# EAGLE design PiPowerHat (EAGLE 7.4.0)
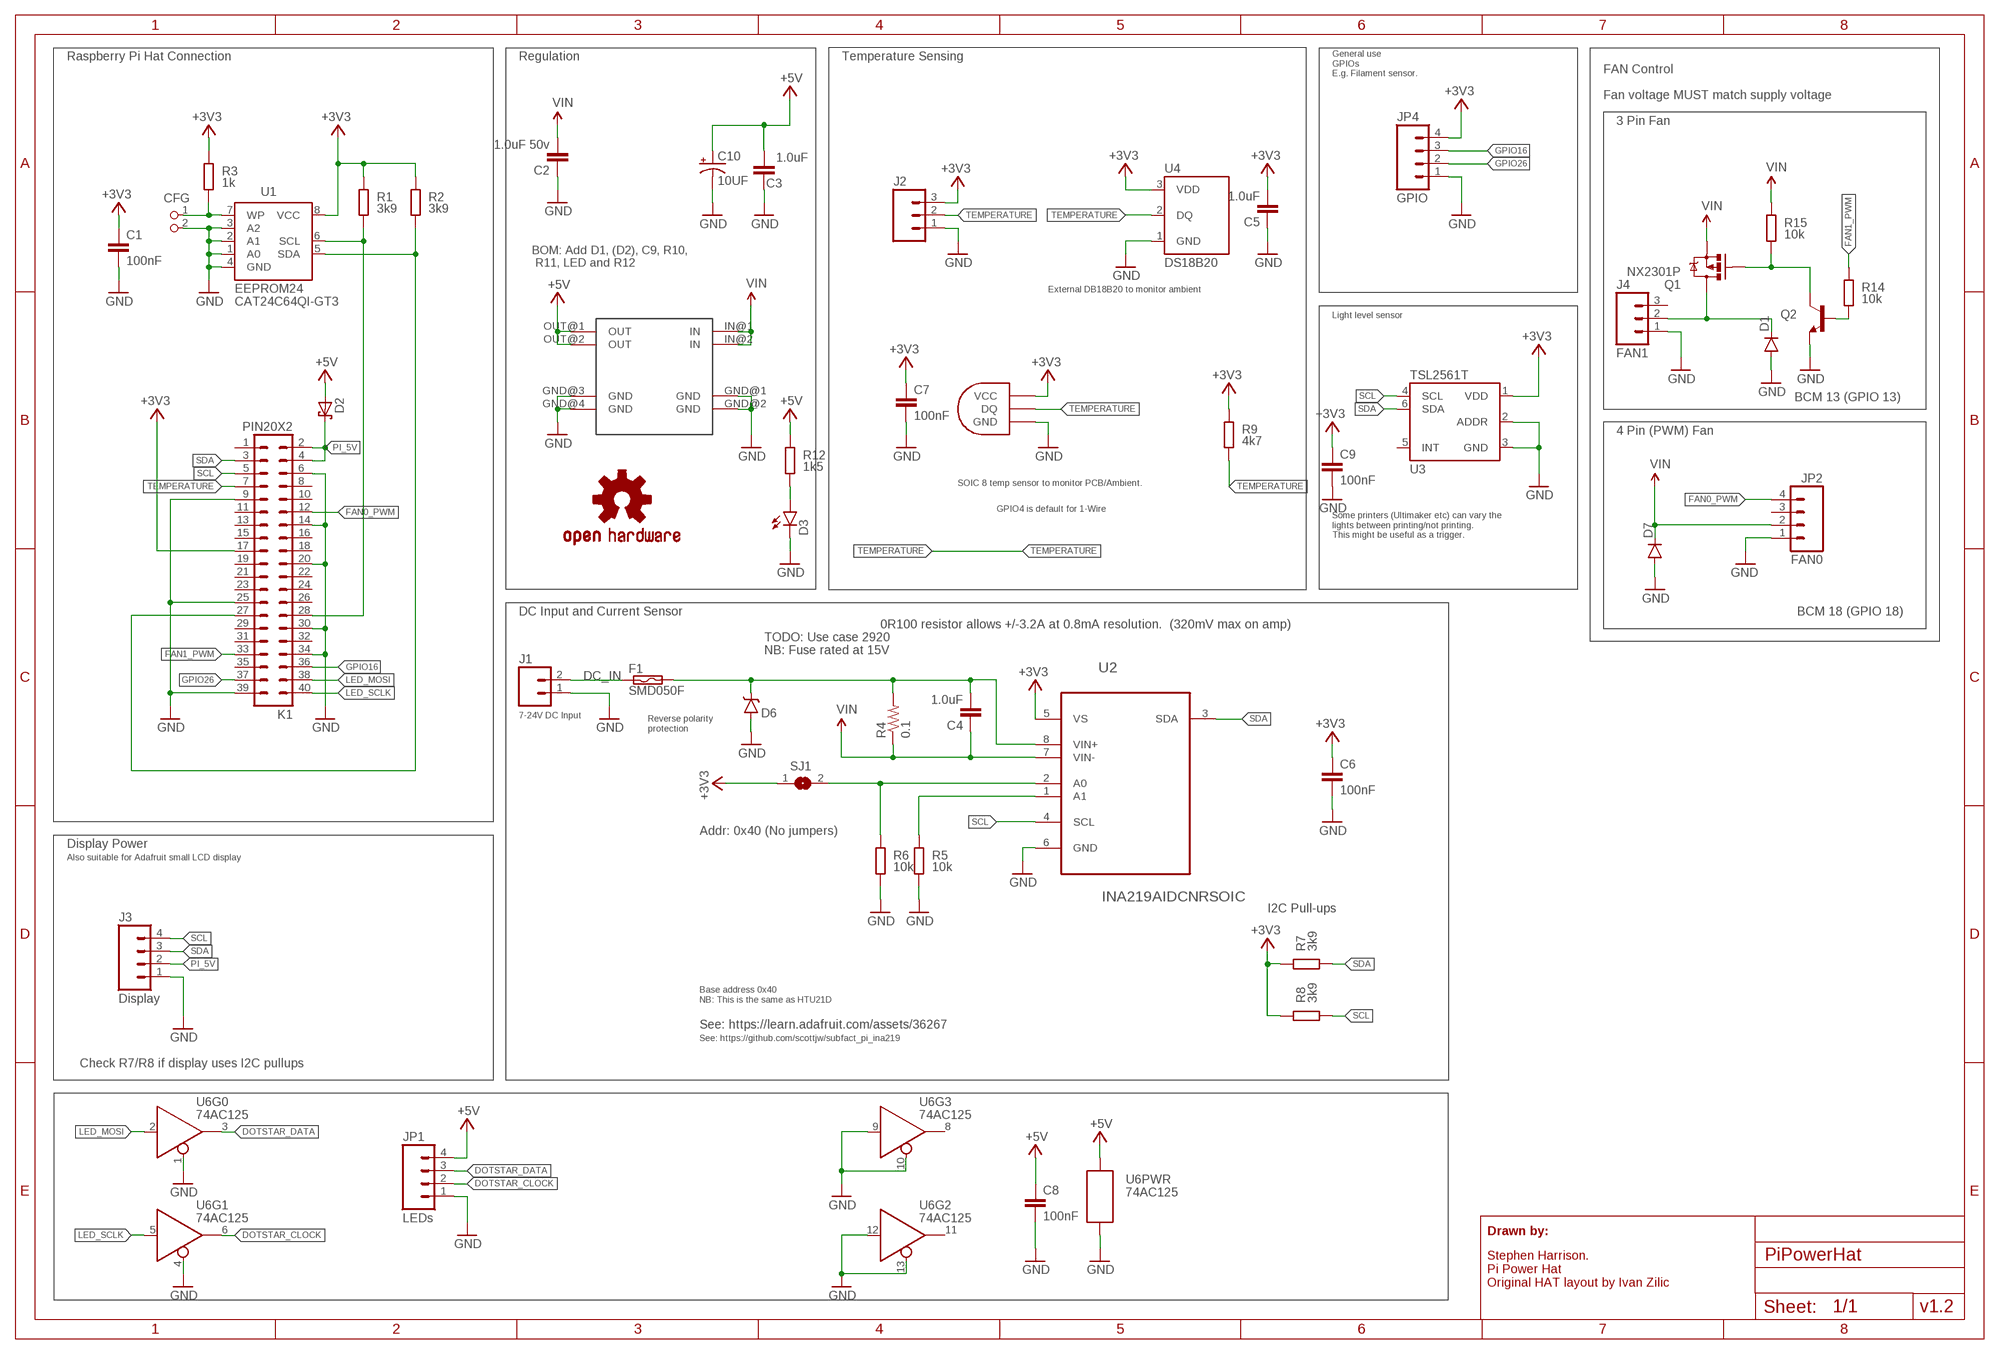
[diagram p0: schematic, sheet 1]

## Parts
C1  100nF  C-EUC0805K  [C0805K]
C2  1.0uF 50v  1.0UF-25V-+80/-20(0805)"  [0805-CAP]
C3  1.0uF  1.0UF-25V-+80/-20(0805)"  [0805-CAP]
C4  1.0uF  1.0UF-25V-+80/-20(0805)"  [0805-CAP]
C5  1.0uF  1.0UF-25V-+80/-20(0805)"  [0805-CAP]
C6  100nF  C-EUC0805K  [C0805K]
C7  100nF  C-EUC0805K  [C0805K]
C8  100nF  C-EUC0805K  [C0805K]
C9  100nF  C-EUC0805K  [C0805K]
C10  10UF  10UF-25V-10%(SMT-TANT)  [EIA6032-NOM]
CFG  PIN2_100  [PIN_W_2]
D1  DIODESOD123  [SOD-123]
D2  MBRS340T3G  SCHOTTKY-DIODESMC  [SMC]
D3  LED1206-BOTTOM  [LED-1206-BOTTOM]
D6  B340A  DIODE-SCHOTTKY-B340A  [SMA-DIODE]
D7  DIODESOD123  [SOD-123]
F1  SMD050F  [SMD050F]
J1  M025MM  [SCREWTERMINAL-5MM-2]
J2  M03POLAR  [MOLEX-1X3]
J3  Display  M04POLAR  [MOLEX-1X4]
J4  FAN1  M03POLAR  [MOLEX-1X3]
JP1  LEDs  M04POLAR  [MOLEX-1X4]
JP2  FAN0  M04POLAR  [MOLEX-1X4]
JP4  GPIO  M04POLAR  [MOLEX-1X4]
K1  PIN20X2  [PIN_20X2]
LOGO1  OSHW-LOGOM  [OSHW-LOGO-M]
Q1  NX2301P  MOSFET-PCHANNEL  [SOT23-3]
Q2  TRANSISTOR_NPNSOT23-3  [SOT23-3]
R1  3k9  R-EU_M0805  [M0805]
R2  3k9  R-EU_M0805  [M0805]
R3  1k  R-EU_M0805  [M0805]
R4  0.1  0.001OHM-3W-1%(2512)3W/1%  [2512]
R5  10k  R-EU_M0805  [M0805]
R6  10k  R-EU_M0805  [M0805]
R7  3k9  R-EU_M0805  [M0805]
R8  3k9  R-EU_M0805  [M0805]
R9  4k7  R-EU_M0805  [M0805]
R12  1k5  R-EU_M0805  [M0805]
R14  10k  R-EU_M0805  [M0805]
R15  10k  R-EU_M0805  [M0805]
SJ1  SJ  [SJ]
U1  EEPROM24  [SOIC8]
U2  INA219AIDCNRSOIC  [SO08]
U3  TSL2561T  [TMB-6]
U4  DS18B20  [TO-92-AMMO]
U5  DS1820SOIC  [DS18B20_SOIC]
U6  74AC125  74AC125DG125  [SO14]
U$1  MINI-BUCK-MODULE-3A  [MINI-BUCK-MODULE-3A]

## Nets
+3V3: C1.1 C5.2 C6.1 C7.1 C9.1 J2.3 JP4.4 K1.17 R1.2 R2.2 R3.2 R7.2 R8.2 R9.2 SJ1.1 U1.8(VCC) U2.5(VS) U3.1(VDD) U4.3(VDD) U5.VCC
+5V: C3.2 C8.1 C10.A(+) D2.A JP1.4 R12.2 U6.14(PWR:P$V+) U$1.OUT@1(OUT) U$1.OUT@2(OUT)
DC_IN: F1.1 J1.2
DOTSTAR_CLOCK: JP1.2 U6.6(Q)
DOTSTAR_DATA: JP1.3 U6.3(Q)
FAN0_PWM: JP2.4 K1.12
FAN1_PWM: K1.33 R14.2
GND: C1.2 C2.1 C3.1 C5.1 C6.2 C7.2 C8.2 C9.2 C10.C(-) CFG.2 D1.A D3.C D6.A D7.A J1.1 J2.1 J3.1 J4.1 JP1.1 JP2.1 JP4.1 K1.6 K1.9 K1.14 K1.20 K1.25 K1.30 K1.34 K1.39 Q2.2(E) R5.1 R6.1 U1.1(A0) U1.2(A1) U1.3(A2) U1.4(GND) U2.6(GND) U3.2(ADDR) U3.3(GND) U4.1(GND) U5.GND U6.1(!EN) U6.4(!EN) U6.7(PWR:P$V-) U6.9(D) U6.10(!EN) U6.12(D) U6.13(!EN) U$1.GND@1(GND) U$1.GND@2(GND) U$1.GND@3(GND) U$1.GND@4(GND)
GPIO16: JP4.3 K1.36
GPIO26: JP4.2 K1.37
ID_SC: K1.28 R1.1 U1.6(SCL)
ID_SD: K1.27 R2.1 U1.5(SDA)
LED_MOSI: K1.38 U6.2(D)
LED_SCLK: K1.40 U6.5(D)
N$3: CFG.1 R3.1 U1.7(WP)
N$4: D3.A R12.1
N$5: C4.2 D6.C F1.2 R4.2 U2.8(VIN+)
N$7: D1.C J4.2 Q1.3(D)
N$8: Q1.1(G) Q2.3(C) R15.1
N$9: R6.2 SJ1.2 U2.2(A0)
N$10: R5.2 U2.1(A1)
N$13: Q2.1(B) R14.1
PI_5V: D2.C J3.2 K1.2 K1.4
SCL: J3.4 K1.5 R8.1 U2.4(SCL) U3.4(SCL)
SDA: J3.3 K1.3 R7.1 U2.3(SDA) U3.6(SDA)
TEMPERATURE: J2.2 K1.7 R9.1 U4.2(DQ) U5.DQ
VIN: C2.2 C4.1 D7.C JP2.2 Q1.2(S) R4.1 R15.2 U2.7(VIN-) U$1.IN@1(IN) U$1.IN@2(IN)
Unconnected: J4.3 JP2.3 K1.1 K1.8 K1.10 K1.11 K1.13 K1.15 K1.16 K1.18 K1.19 K1.21 K1.22 K1.23 K1.24 K1.26 K1.29 K1.31 K1.32 K1.35 U3.5(INT) U6.8(Q) U6.11(Q)

## Notes on the sheet
- Raspberry Pi Hat Connection | Regulation | Temperature Sensing
- FAN Control
- General use
  GPIOs
  E.g. Filament sensor.
- Fan voltage MUST match supply voltage
- 3 Pin Fan
- BOM: Add D1, (D2), C9, R10,
   R11, LED and R12
- External DB18B20 to monitor ambient
- CAT24C64QI-GT3
- Light level sensor
- BCM 13 (GPIO 13)
- 4 Pin (PWM) Fan
- SOIC 8 temp sensor to monitor PCB/Ambient.
- GPIO4 is default for 1-Wire
- Some printers (Ultimaker etc) can vary the 
  lights between printing/not printing. 
  This might be useful as a trigger.
- DC Input and Current Sensor | BCM 18 (GPIO 18)
- 0R100 resistor allows +/-3.2A at 0.8mA resolution.  (320mV max on amp)
- TODO: Use case 2920
- NB: Fuse rated at 15V
- 7-24V DC Input
- Reverse polarity
  protection
- Addr: 0x40 (No jumpers)
- Display Power
- Also suitable for Adafruit small LCD display
- I2C Pull-ups
- Base address 0x40
  NB: This is the same as HTU21D
- See: https://learn.adafruit.com/assets/36267
- See: https://github.com/scottjw/subfact_pi_ina219
- Check R7/R8 if display uses I2C pullups
- Drawn by:
- Stephen Harrison.
  Pi Power Hat 
  Original HAT layout by Ivan Zilic
- v1.2

## Library data of the parts
C1 C6-C9 = resistor:C-EU: CAPACITOR, European symbol; DIELECTRIC: X7R
C2 = SparkFun-Capacitors:1.0UF-25V-+80/-20(0805): CAP-11625; PROD_ID: CAP-11625; VALUE: 1.0uF
C3-C5 = SparkFun-Capacitors:1.0UF-25V-+80/-20(0805): CAP-11625; PROD_ID: CAP-11625
C10 = SparkFun-Capacitors:10UF-25V-10%(SMT-TANT): http://www.digikey.com/product-detail/en/T491C106K025AT7280/399-10159-2-ND/3759638; PROD_ID: CAP-12984
CFG = FLYFISH:PIN2
D1 D7 = SparkFun-DiscreteSemi:DIODE: Diode These are standard reverse protection diodes and small signal diodes. SMA package can handle up to about 1A. SOD-323 can handle about 200mA. What the SOD-323 package when ordering, there are some mfgs out there that are 5-pin packages.
D2 = diode:SCHOTTKY-DIODE: Schottky Diode; FARNELL: 9557377
D3 = SparkFun-LED:LED: LEDs Standard schematic elements and footprints for 5mm, 3mm, 1206, and 0603 sized LEDs. 5mm - Spark Fun Electronics SKU : COM-00529 (and others)
D6 = SparkFun-DiscreteSemi:DIODE-SCHOTTKY: Schottky diodes in SFE's production catalog BAT20J 1A 23V 0.62Vf RB751 120mA 40V 0.37Vf PMEG4005EJ 0.5A 40V 0.42Vf MBRA140 1A 40V 0.5Vf B340A 3A 40V SMA; PROD_ID: DIO-09886
F1 = switch-raychem:SMD*F: PolySwitch (TM) Resettable Device Source: Data sheet <http://www.farnell.com/datasheets/13482.pdf>; FARNELL: 1822231; FARNELL-1: 1822225
J1 = SparkFun-Connectors:M02: Standard 2-pin 0.1" header. Use with - straight break away headers ( PRT-00116) - right angle break away headers (PRT-00553) - swiss pins (PRT-00743) - machine pins (PRT-00117) - female headers (PRT-00115) Molex polarized connector foot print use with: PRT-08233 with associated crimp pins and housings. 2.54_SCREWTERM for use with PRT-10571. 3.5mm Screw Terminal footprints for PRT-08084 5mm Screw Terminal footprints for use with PRT-08432; STOREFRONT_ID: PRT-08432
J2 J4 = SparkFun-Connectors:M03: Header 3 Standard 3-pin 0.1" header. Use with straight break away headers (SKU : PRT-00116), right angle break away headers (PRT-00553), swiss pins (PRT-00743), machine pins (PRT-00117), and female headers (PRT-00115). Molex polarized connector foot print use with SKU : PRT-08232 with associated crimp pins and housings.
J3 JP1 JP2 JP4 = SparkFun-Connectors:M04: Header 4 Standard 4-pin 0.1" header. Use with straight break away headers (SKU : PRT-00116), right angle break away headers (PRT-00553), swiss pins (PRT-00743), machine pins (PRT-00117), and female headers (PRT-00115). Molex polarized connector foot print use with SKU : PRT-08231 with associated crimp pins and housings. 1MM SMD Version SKU: PRT-10208
K1 = FLYFISH:PIN20X2
LOGO1 = SparkFun-Aesthetics:OSHW-LOGO: Open Source Hardware Logo This logo indicates the piece of hardware it is found on incorporates a OSHW license and/or adheres to the definition of open source hardware found here: http://freedomdefined.org/OSHW
Q1 = SparkFun-DiscreteSemi:MOSFET-PCHANNEL: Generic PMOSFET IRLML2244 - TRANS-11153 (SOT-23 -20V -4.3A) (1.Gate 2.Source 3.Drain) FQP27P06 - COM-10349 <http://www.sparkfun.com/products/10349> (TO-220 -60V -27A) (1.Gate 2.Source 3.Drain); PROD_ID: TRANS-08285
Q2 = SparkFun-DiscreteSemi:TRANSISTOR_NPN: Generic NPN BJT MMBT2222A - TRANS-08049 (SOT-23, 1A 40V) MPSA42 - TRANS-09116 (SOT-23, 500mA 300V) MMBT5088LT1G - TRANS-11160 (SOT-23, 50 mA 30V) BC547 - COM-08928 <http://www.sparkfun.com/products/8928> (TO-92 45V 100mA) (1.Collector 2.Base 3.Emitter) 2N3904 - COM-00521 <http://www.sparkfun.com/products/521> (TO-92 40V 200mA) (1.Emitter 2.Base 3.Collector) P2N2222A - COM-12852 <http://www.sparkfun.com/products/12852> (TO-92 40V 600mA) (1.Collector 2.Base 3.Emitter); PROD_ID: TRANS-08049
R1-R3 R5-R9 R12 R14 R15 = resistor:R-EU_: RESISTOR, European symbol; TOLERANCE: 5%
R4 = SparkFun-Resistors:0.001OHM-3W-1%(2512); PROD_ID: RES-12449; VALUE: 0.001
SJ1 = jumper:SJ: SMD solder JUMPER
U1 = FLYFISH:EEPROM24; FARNELL: 2463718
U2 = INA219AIDCNR:INA219AIDCNR: CURRENT/POWER MONITOR
U3 = SparkFun-Sensors:TSL2561: TSL2561 illumination sensor Approximates Human Eye Response Precisely Measures Illuminance Programmable Interrupt Function with User-Defined Upper and Lower Threshold 400 KHz I2C interface Programmable Analog Gain and Integration Time Supporting 1,000,000-to-1 Dynamic Range Automatically Rejects 50/60-Hz Lighting Ripple Low Active Power (0.75 mW Typical) with Power Down Mode RoHS Compliant The TSL2561 is a light-to-digital converter that transform light intensity to a digital signal output via I2C interface. The device combines one broadband photodiode (visible plus infrared) and one infrared-responding photodiode on a single CMOS integrated circuit capable of providing a near-photopic response over an effective 20-bit dynamic range (16-bit resolution). Two integrating ADCs convert the photodiode currents to a digital output that represents the irradiance measured on each channel. This digital output can be input to a microprocessor where illuminance (ambient light level) in lux is derived using an empirical formula to approximate the human eye response. The TSL2561 device supports a traditional level style interrupt that remains asserted until the firmware clears it.
U4 = SparkFun-Sensors:DS18B20: Dallas/Maxim DS18B20 1-wire temperature sensor Datasheet: http://datasheets.maximintegrated.com/en/ds/DS18B20.pdf temp thermometer 1-wire one-wire one wire; STORE_ID: SEN-00245
U5 = DS1820-SOIC:DS1820
U6 = SparkFun-DigitalIC:74*125; PROD_ID: IC-08880
U$1 = Tinamous:MINI-BUCK-MODULE-3A

## Board
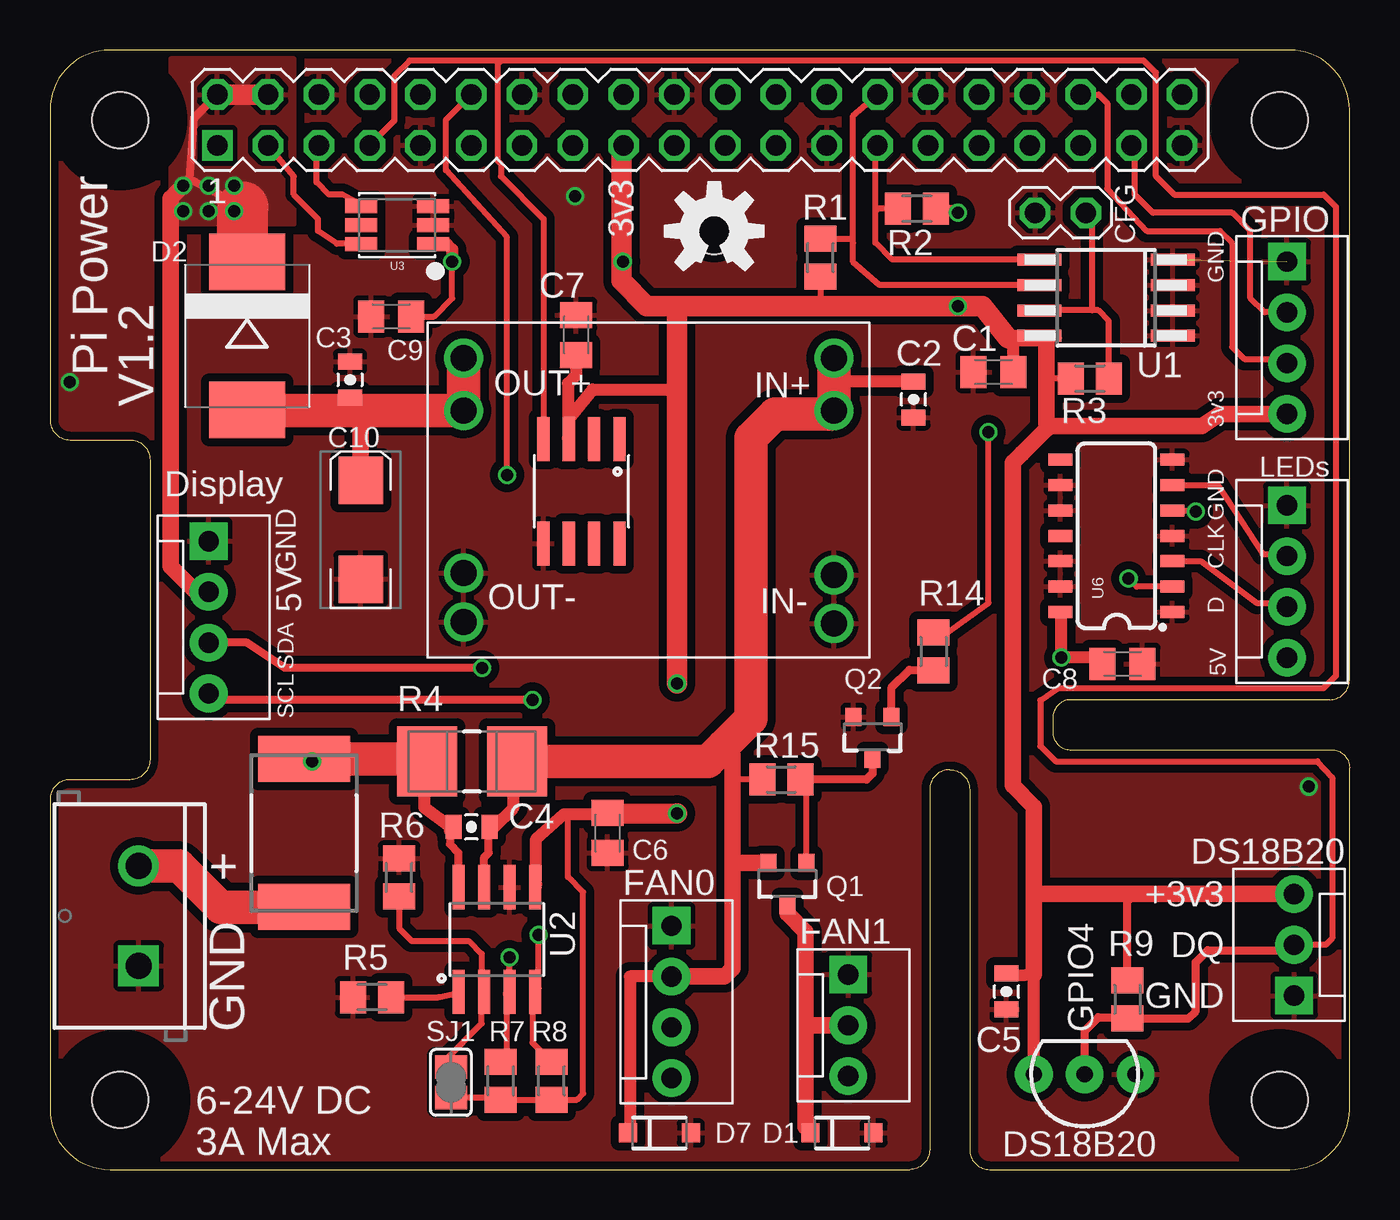
[diagram p1: board, top side]
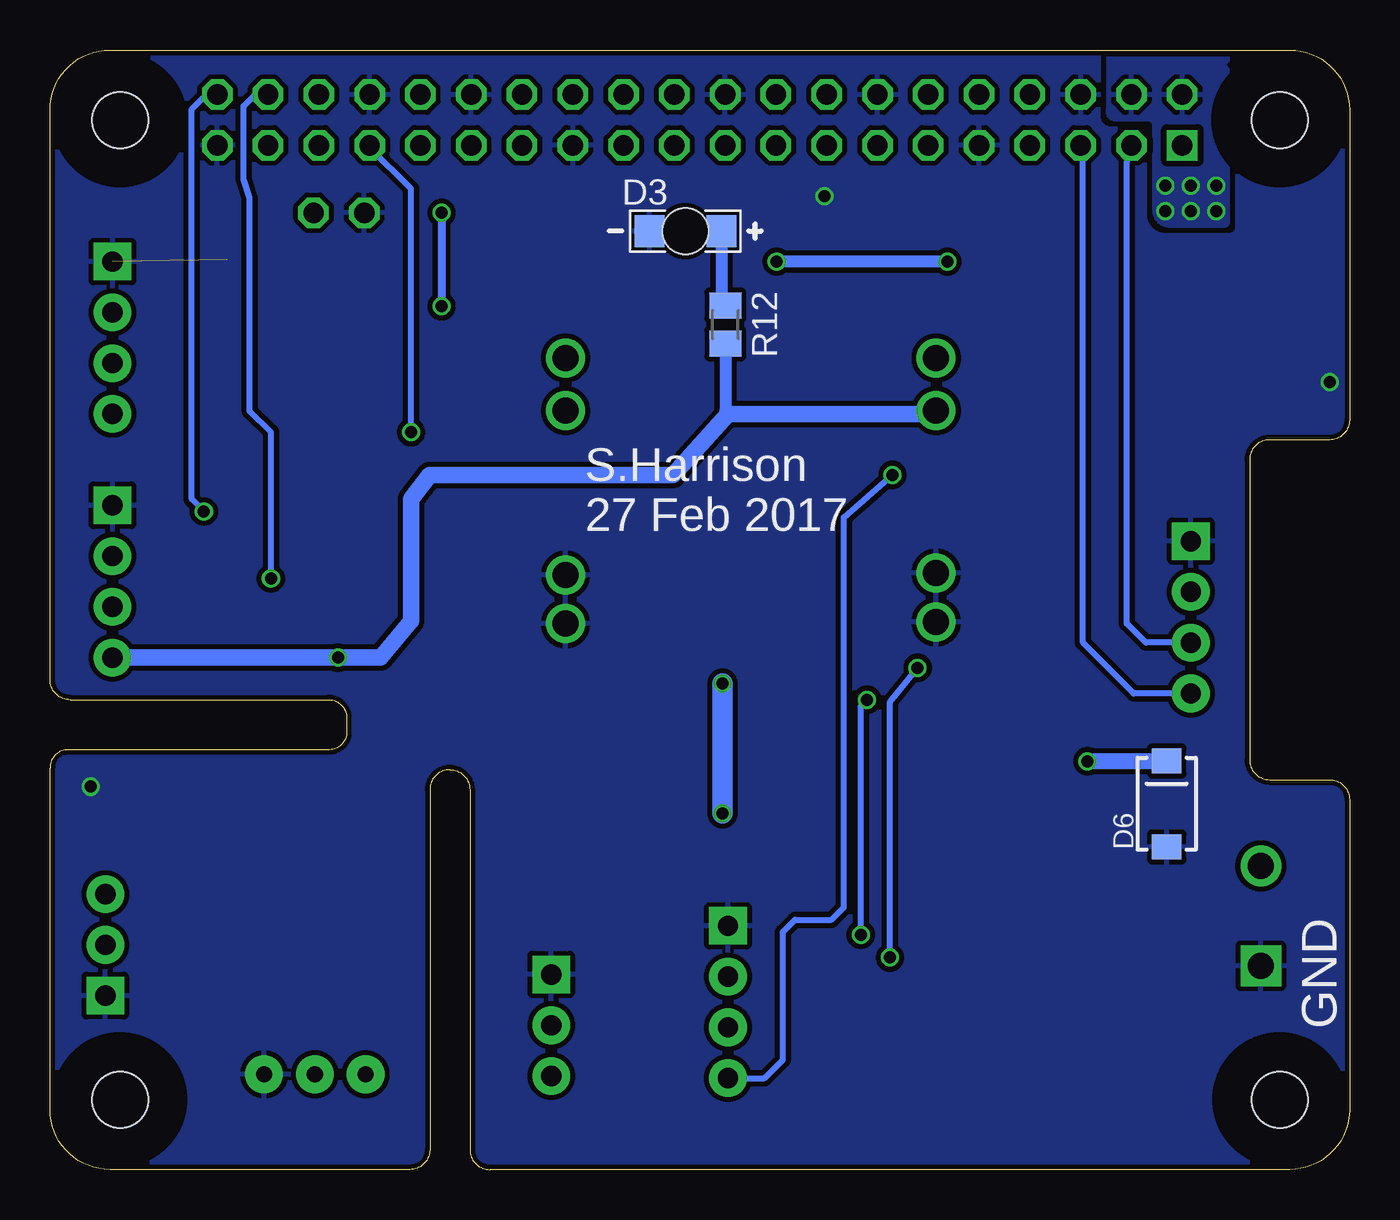
[diagram p2: board, bottom side, seen from below]

Size 65 x 56 mm. Coordinates in mm from the lower left corner, seen from the top.
Outline: 0,3 arc90 3,0 43,0 arc90 44,1 44,19 arc-90 45,20 arc-90 46,19 46,1 arc90 47,0 62,0 arc90 65,3 65,20.1 arc90 64.1,21 51.1,21 arc-90 50.16,21.81 50.16,22.64 arc-90 51.1,23.5 64,23.5 arc90 65,24.5 65,53 arc90 62,56 3,56 arc90 0,53 0,37.5 arc90 1,36.5 4,36.5 arc-90 5,35.5 5,20.5 arc-90 4,19.5 1,19.5 arc90 0,18.5 0,3
Copper layers (1*16): Top 0.035mm / dielectric 1.5mm / Bottom 0.035mm
Design rules "dirt_cheap_dirty_boards.v1": minimum track width 5mil, minimum drill 12mil, track to track 5mil, track to pad 5mil, pad to pad 5mil, via to via 5mil, smd to smd 0mil, copper to edge 10mil, drill to drill 10mil, minimum pad ring 10mil, minimum via ring 6mil, stop-mask expansion 2mil, vias tented up to drill 25mil, thermal gap 10mil
Holes 2.8 mm at 3.5,3.5 3.5,52.5 61.5,52.5 61.5,3.5
tRestrict: area 1.9,51 to 5,54; area 60,51 to 63,54; area 60,1.9 to 63,5; area 1.9,1.9 to 5,5
bRestrict: area 1.9,1.9 to 5,5; area 1.9,51 to 5,54; area 60,1.9 to 63,5; area 60,51 to 63,54

### Footprints (pad centres in the part's own frame; a part is rotated, then mirrored left to right if it is on the bottom)
C0805K = smd 1.3 x 1.6: 1 -1,0; 2 1,0
0805-CAP = smd 0.8 x 1.2: 1 -0.9,0; 2 0.9,0
EIA6032-NOM = smd 2.37 x 2.23: A 2.47,0; C -2.47,0
PIN_W_2 = drill 1.016 octagon: 1 0,0; 2 0,-2.54
SOD-123 = smd 0.9 x 0.95: A 1.575,0; C -1.575,0
SMC = smd 2.8 x 3.8: A 3.7,0; C -3.7,0
LED-1206-BOTTOM = smd 1.5 x 1.6: A -1.8,0; C 1.8,0 | hole 2.3: 0,0
SMA-DIODE = smd 1.27 x 1.47: A -2.15,0; C 2.15,0
SMD050F = smd 2.3 x 4.6: 1 -3.7,0; 2 3.7,0
SCREWTERMINAL-5MM-2 = drill 1.3 pad 2.032 square: 1 0,0 | drill 1.3 pad 2.032: 2 5,0
MOLEX-1X3 = drill 1.016 pad 1.88 square: 1 0,0 | drill 1.016 pad 1.88: 2 2.54,0; 3 5.08,0
MOLEX-1X4 = drill 1.016 pad 1.88 square: 1 0,0 | drill 1.016 pad 1.88: 2 2.54,0; 3 5.08,0; 4 7.62,0
PIN_20X2 = drill 1.016 square: 1 -24.13,-1.27 | drill 1.016 octagon: 2 -24.13,1.27; 3 -21.59,-1.27; 4 -21.59,1.27; 5 -19.05,-1.27; 6 -19.05,1.27; 7 -16.51,-1.27; 8 -16.51,1.27; 9 -13.97,-1.27; 10 -13.97,1.27; 11 -11.43,-1.27; 12 -11.43,1.27; 13 -8.89,-1.27; 14 -8.89,1.27; 15 -6.35,-1.27; 16 -6.35,1.27; 17 -3.81,-1.27; 18 -3.81,1.27; 19 -1.27,-1.27; 20 -1.27,1.27; 21 1.27,-1.27; 22 1.27,1.27; 23 3.81,-1.27; 24 3.81,1.27; 25 6.35,-1.27; 26 6.35,1.27; 27 8.89,-1.27; 28 8.89,1.27; 29 11.43,-1.27; 30 11.43,1.27; 31 13.97,-1.27; 32 13.97,1.27; 33 16.51,-1.27; 34 16.51,1.27; 35 19.05,-1.27; 36 19.05,1.27; 37 21.59,-1.27; 38 21.59,1.27; 39 24.13,-1.27; 40 24.13,1.27
SOT23-3 = smd 0.8 x 0.9: 1 -0.95,-1; 2 0.95,-1; 3 0,1.1
M0805 = smd 1.3 x 1.6: 1 -0.95,0; 2 0.95,0
2512 = smd 3 x 3.5: 1 -2.25,0; 2 2.25,0
SJ = smd 1.168 x 1.6: 1 -0.762,0; 2 0.762,0
SOIC8 = smd 0.6 x 2.2: 1 -1.905,-3.33; 2 -0.635,-3.33; 3 0.635,-3.33; 4 1.905,-3.33; 5 1.905,3.33; 6 0.635,3.33; 7 -0.635,3.33; 8 -1.905,3.33
SO08 = smd 0.61 x 2.21: 1 -1.905,-2.616; 2 -0.635,-2.616; 3 0.635,-2.616; 4 1.905,-2.616; 5 1.905,2.616; 6 0.635,2.616; 7 -0.635,2.616; 8 -1.905,2.616
TMB-6 = smd 1.6 x 0.7: 1 -1.8,0.95; 2 -1.8,0; 3 -1.8,-0.95; 4 1.8,-0.95; 5 1.8,0; 6 1.8,0.95
TO-92-AMMO = drill 0.813 pad 1.88: 1 -2.54,0; 2 0,0; 3 2.54,0
DS18B20_SOIC = smd 0.61 x 2.21: DQ 1.905,-2.616; GND 1.905,2.616; NC -1.905,-2.616; NC2 -0.635,-2.616; NC3 -1.905,2.616; NC4 -0.635,2.616; NC5 0.635,2.616; VCC 0.635,-2.616
SO14 = smd 0.6 x 1.2: 1 -3.81,-2.8; 2 -2.54,-2.8; 3 -1.27,-2.8; 4 0,-2.8; 5 1.27,-2.8; 6 2.54,-2.8; 7 3.81,-2.8; 8 3.81,2.8; 9 2.54,2.8; 10 1.27,2.8; 11 0,2.8; 12 -1.27,2.8; 13 -2.54,2.8; 14 -3.81,2.8
MINI-BUCK-MODULE-3A = drill 1.3: GND@1 20.32,4.13; GND@2 20.32,1.7; GND@3 1.778,4.228; GND@4 1.778,1.778; IN@1 20.32,14.986; IN@2 20.32,12.356; OUT@1 1.778,14.986; OUT@2 1.778,12.356

### Placement (x,y rotation side)
C1  47.19,39.89 180 top
C2  43.2,38.52 90 top
C3  15.01,39.51 270 top
C4  21.09,17.13 180 top
C5  47.84,8.9 90 top
C6  27.89,16.83 270 top
C7  26.31,41.74 90 top
C8  53.64,25.3 0 top
C9  17.07,42.67 180 top
C10  15.54,32 90 top
CFG  51.82,47.85 270 top
D1  39.62,1.83 0 top
D2  9.86,41.7 270 top
D3  33.22,46.94 180 bottom
D6  9.14,18.29 90 bottom
D7  30.48,1.83 0 top
F1  12.7,16.83 90 top
J1  4.43,10.19 90 top
J2  62.23,8.7 90 top
J3  7.94,31.43 270 top
J4  39.93,9.75 270 top
JP1  61.87,33.22 270 top
JP2  31.09,12.19 270 top
JP4  61.87,45.42 270 top
K1  32.5,52.5 0 top
LOGO1  33.22,46.94 0 top
Q1  36.88,14.33 180 top
Q2  41.15,21.64 180 top
R1  38.53,45.6 270 top
R2  43.36,48.05 0 top
R3  52.01,39.56 180 top
R4  21.1,20.41 180 top
R5  16.1,8.62 0 top
R6  17.46,14.61 270 top
R7  22.54,4.45 270 top
R8  25.08,4.45 270 top
R9  53.89,8.51 90 top
R12  31.22,42.27 270 bottom
R14  44.2,25.91 90 top
R15  36.58,19.51 180 top
SJ1  20.05,4.36 90 top
U1  52.82,43.61 90 top
U2  22.35,11.51 0 top
U3  17.37,47.24 180 top
U4  51.75,4.76 180 top
U5  26.58,33.92 180 top
U6  53.34,31.7 90 top
U$1  18.9,25.6 0 top

### Tracks (layer width: path | path; a pad name or v marks a point on that pad's centre or on a via)
+3V3  (via drill 0.6)
  Top 0.305: R1.2 38.53,43.38 38.73,43.18 | 50.48,41.59 49.85,41.59 49.6,41.59 U1.8 | SJ1.1 22.44,3.6 R7.2 R8.2 26.36,3.5 26.67,3.81 26.67,13.87 25.91,14.63 25.91,17.78 | 51.79,37.34 51.79,37.21 51.82,37.19 | R3.2 49.91,39.56 49.85,39.01 | v28.65,45.41 28.57,45.41 | C9.1 19.2,42.67 20.12,43.59 v20.12,45.41
  Top 0.406: 49.28,11.82 49.21,14.33 | R9.2 53.89,13.41 54.25,13.78 | R2.2 45.21,48.05 v45.41,47.85
  Top 0.61: U2.5 24.31,14.12 24.32,14.29 24.32,16.54 25.72,17.78 25.91,17.78 27.23,17.78 C6.1 | 49.6,41.59 47.9,41.59 48.19,41.52 C1.1 | U4.3 49.21,9.75 48.35,9.7 C5.2 | 31.36,39.01 27.13,39.01 25.95,37.53 U5.VCC 25.91,36.58 25.91,39.32 26.31,39.73 C7.1 | U3.1 19.85,46.29 20.12,46.02 v20.12,45.41 | 49.21,14.33 49.21,13.87 49.3,13.78
  Top 0.813: 49.85,37.19 49.85,39.01 49.85,41.59 47.9,41.59 | 49.85,37.19 49.85,37.03 48.62,35.81 | 48.62,35.81 48.2,35.4 | JP4.4 58.52,37.8 57.61,37.19 51.82,37.19 49.85,37.19 | 49.21,9.75 49.21,14.33 49.21,18.15 48.16,19.2 48.16,35.35 48.62,35.81 | J2.3 54.25,13.78 49.3,13.78
  Top 1.016: K1.17 28.57,51.12 28.57,45.41 28.57,44.45 29.84,43.18 31.36,43.18 | 31.36,43.18 38.73,43.18 v45.41,43.18 46.63,43.18 47.9,41.59 | C6.1 27.84,17.83 28.21,17.79 28.26,17.79 v31.36,17.82 | v31.36,24.32 31.36,39.01 31.36,43.18
  Bottom 0.406: v45.41,47.85 v45.41,43.18
  Bottom 0.61: v20.12,45.41 v28.65,45.41
  Bottom 1.016: v31.36,17.82 v31.36,24.32
+5V  (via drill 0.6)
  Top 0.61: C8.1 52.58,25.6 v50.6,25.6 50.6,27.83 U6.14 | C3.2 20.53,37.81 U$1.OUT@2
  Top 0.813: C10.A 15.54,37.65 15.85,37.96
  Top 1.676: 9.84,37.98 D2.A 9.9,37.96 15.85,37.96 U$1.OUT@2 U$1.OUT@1
  Bottom 0.61: R12.2 31.22,37.92 31.09,37.8
  Bottom 0.813: JP1.4 v50.6,25.6 48.46,25.6 46.94,27.43 46.94,33.53 46.02,34.75 33.83,34.75 31.09,37.8 21.12,37.8 U$1.OUT@2
DC_IN
  Top 1.27: 12.5,12.92 F1.1
  Top 1.676: J1.2 6.46,15.19 8.53,13.11 12.68,13.11 F1.1
  Top 1.778: 12.49,13.34 F1.1
DOTSTAR_CLOCK
  Top 0.305: U6.6 58.42,34.24 60.66,30.79 61.77,30.79 JP1.2
DOTSTAR_DATA
  Top 0.305: U6.3 57.56,30.43 60.35,28.35 61.77,28.35 JP1.3
FAN0_PWM  (via drill 0.6)
  Top 0.305: v22.86,34.75 22.86,46.63 19.81,49.99 19.81,52.51 K1.12
  Bottom 0.305: JP2.4 29.26,4.57 28.35,5.49 28.35,11.89 27.74,12.5 25.91,12.5 25.3,13.11 25.3,32.61 v22.86,34.75
FAN1_PWM  (via drill 0.6)
  Top 0.305: R14.2 44.81,26.82 46.94,28.35 v46.94,36.88
  Bottom 0.305: v46.94,36.88 46.94,49.07 49.07,51.17 K1.33
GND  (via drill 0.6)  (1 unrouted)
  other vias: 0.98,39.4 26.26,48.69 62.95,19.15
  pour Bottom (isolate 0.254, rank 6): 0,3 arc90 3,0 43,0 arc90 44,1 44,19 arc-90 45,20 arc-90 46,19 46,1 arc90 47,0 62,0 arc90 65,3 65,53 arc90 62,56 3,56 arc90 0,53 0,37.5 arc90 1,36.5 4,36.5 arc-90 5,35.5 5,20.5 arc-90 4,19.5 1,19.5 arc90 0,18.5
  pour Top (isolate 0.406, rank 5): 0,3 arc90 3,0 43,0 arc90 44,1 44,19 arc-90 45,20 arc-90 46,19 46,1 arc90 47,0 62,0 arc90 65,3 65,53 arc90 62,56 3,56 arc90 0,53 0,37.5 arc90 1,36.5 4,36.5 arc-90 5,35.5 5,20.5 arc-90 4,19.5 1,19.5 arc90 0,18.5
GPIO16
  Top 0.305: K1.36 52.45,53.77 52.88,53.34 52.88,49.07 54.86,46.94 58.52,46.94 59.13,46.33 59.13,41.15 59.74,40.54 61.77,40.54 JP4.3
GPIO26
  Top 0.305: JP4.2 60.76,42.88 60.05,43.59 60.05,46.94 59.13,47.85 55.17,47.85 54.25,48.77 54.25,51.07 K1.37
ID_SC
  Top 0.305: U1.6 41.48,44.24 40.17,45.39 40.17,46.35 | 40.17,46.35 40.17,52.7 K1.28 | R1.1 40.06,46.56 40.17,46.35
ID_SD
  Top 0.305: U1.5 42.12,45.52 41.27,46.35 41.27,47.94 | 41.27,47.94 41.27,51.12 K1.27 | R2.1 41.39,48.05 41.27,47.94
LED_MOSI  (via drill 0.6)
  Top 0.305: U6.2 54.36,29.16 v53.95,29.57
  Bottom 0.305: v53.95,29.57 53.95,36.88 55.02,37.95 55.02,48.62 55.32,49.53 55.32,53.19 54.71,53.8 54.06,53.8 K1.38
LED_SCLK  (via drill 0.6)
  Top 0.305: U6.5 57.25,32.97 v57.3,32.92
  Bottom 0.305: v57.3,32.92 57.91,33.53 57.91,53.03 57.3,53.65 56.76,53.65 K1.40
N$3
  Top 0.305: R3.1 52.96,42.45 52.43,42.98 52.12,42.98 | 52.12,42.98 50.19,42.98 | CFG.1 51.98,47.38 52.12,47.24 52.12,42.98
  Top 0.406: U1.7 50.19,42.98
N$4
  Bottom 0.61: D3.A 31.42,43.42 R12.1
N$5  (via drill 0.6)
  Top 0.406: 20,16.95 20,16.27 20.42,15.85 20.42,14.14 U2.8
  Top 0.61: R4.2 18.73,20.29 18.73,18.1 20.02,17.13 C4.2 20,16.95
  Top 0.813: 13.82,20.53 v13.11,20.42
  Top 1.676: F1.2 13.82,20.53 18.18,20.53 R4.2
  Bottom 0.813: v13.11,20.42 13.12,20.42 D6.C
N$7
  Top 0.813: J4.2 37.9,7.21 37.8,7.32 | 37.8,7.32 37.8,11.89 36.88,12.8 Q1.3 | D1.C 38.05,1.88 37.8,2.13 37.8,7.32
N$8
  Top 0.305: Q1.1 37.83,19.2 R15.1
  Top 0.406: Q2.3 41.15,19.81 40.84,19.51 R15.1
N$9
  Top 0.305: SJ1.2 19.74,5.45 21.59,7.3 21.59,8.76 U2.2 21.59,9.01 21.59,10.79 20.95,11.43 18.1,11.43 17.46,12.06 R6.2
N$10
  Top 0.305: U2.1 20.45,9.59 20.42,9.61 20.42,8.84 19.42,8.62 R5.2
N$13
  Top 0.406: Q2.1 42.1,24.11 42.98,24.99 44.16,24.99 R14.1
PI_5V  (via drill 0.6)
  Top 0.406: 9.64,48.16 6.99,49.53 7.2,52.6 K1.2
  Top 0.813: J3.2 7.3,28.89 6.03,30.16 6.03,48.58 v6.67,49.21
  Top 1.016: D2.C 9.64,45.72 | K1.2 K1.4
  Top 2.54: 9.64,45.72 9.64,48.16
  other vias: 9.21,49.21 6.67,47.94 9.21,47.94 7.94,49.21 7.94,47.94
  pour Top (isolate 0.254): 6.03,55.56 6.03,47.31 12.22,47.31 12.22,55.56
  pour Bottom (isolate 0.305, rank 3): 6.35,55.88 11.75,55.88 arc-90 12.06,55.56 12.06,53.02 arc-90 11.75,52.55 10.03,52.55 arc90 9.75,52.27 9.75,48.01 arc-90 8.99,47.24 6.25,47.24 arc-90 6.1,47.4 6.1,54.36 arc-90 6.35,55.24 6.03,55.56
SCL  (via drill 0.6)
  Top 0.305: U2.4 24.45,9.08 v24.45,11.75 | U2.4 24.13,8.76 24.13,6.35 R8.1 | U3.4 15.27,48.43 14.63,48.77 13.95,48.77 13.34,49.38 13.34,51.12 K1.5
  Top 0.406: U2.4 | v24.13,23.5 8.26,23.5 J3.4
  Bottom 0.305: J3.4 10.79,23.81 13.34,26.35 13.34,50.8 K1.5 | v24.45,11.75 24.45,23.18 v24.13,23.5
SDA  (via drill 0.6)
  Top 0.305: 22.86,9.01 U2.3 v22.98,10.6 | 22.86,8.76 22.86,5.71 R7.1 | U3.6 15.57,46.3 14.35,46.3 13.41,46.94 13.41,47.55 12.19,48.77 12.19,49.68 10.97,51.17 K1.3
  Top 0.406: 22.86,8.76 U2.3 | v21.6,25.09 11.75,25.09 9.84,26.35 J3.3
  Bottom 0.305: J3.3 10.19,26.35 11.14,27.3 11.14,50.39 K1.3 | v22.98,10.6 22.98,23.39 v21.6,25.09
TEMPERATURE
  Top 0.305: J2.2 63.82,11.24 64.14,11.56 64.14,19.62 63.4,20.42 50.3,20.42 49.53,21.18 49.53,23.47 50.44,24.08 63.7,24.08 64.31,24.69 64.31,48.16 63.7,48.77 56.24,48.77 55.32,49.68 55.32,54.86 54.71,55.47 22.55,55.47 | 22.55,55.47 17.98,55.47 17.22,54.71 17.22,52.46 K1.7 | U5.DQ 24.69,38.38 24.69,47.55 22.55,49.68 22.55,50.29 22.4,50.44 22.4,55.32 22.55,55.47
  Top 0.406: U4.2 51.75,6.95 52.43,7.62 53.83,7.62 R9.1 56.94,7.56 57.3,7.92 57.3,10.36 57.91,10.97 61.89,10.97 J2.2
VIN
  Top 0.305: R15.2 34.14,19.51
  Top 0.406: U2.7 21.71,15.62 21.95,15.85 21.95,17.09 C4.1
  Top 0.61: 21.7,14.13 U2.7 | R4.1 23.18,20.23 23.18,18.1 22.21,17.13 C4.1 21.91,17.05 | 34.17,13.98 34.14,14.02 | JP2.2 29.01,9.65 29.01,1.93 D7.C | C2.2 39.42,39.42 39.32,39.52
  Top 0.813: JP2.2 33.73,9.65 34.14,10.06 34.14,14.02 34.14,15.24 | 34.14,15.24 34.14,19.51 34.14,20.73 33.68,21.18 | Q1.2 34.22,15.33 34.14,15.24 | 39.32,39.52 39.22,39.62
  Top 1.676: 23.58,20.64 R4.1 23.37,20.42 32.92,20.42 33.68,21.18 35.05,22.55 35.05,36.58 36.27,37.8 39.05,37.8 U$1.IN@2 39.22,39.62 U$1.IN@1

### Text on the board
tNames: Pi Power | 3v3 | GPIO | GND | V1.2 | 3v3 | LEDs | GND | Display | GND | CLK | D | 5V | SDA | 5V | SCL | DS18B20 | + | FAN0 | +3v3 | GND | GPIO4 | DQ | FAN1 | GND | 6-24V DC | 3A Max | DS18B20
bNames: S.Harrison / 27 Feb 2017 | GND